# Altium schematic sheet Sensor.SchDoc
size A4; SheetNumber: 7; SheetTotal: 12
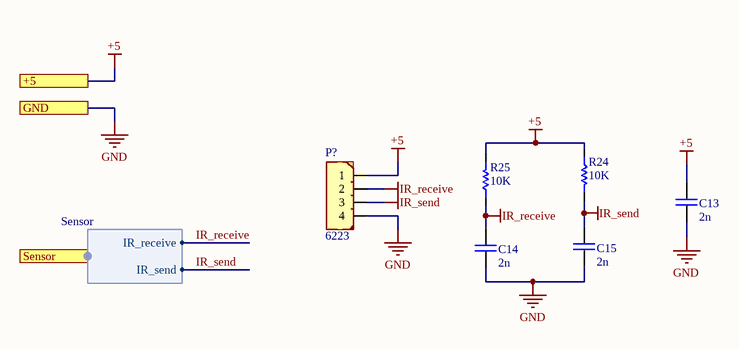
[diagram p0: Sensor.SchDoc]

## Parts
C13  2n  [CAP 1206/3216]
C14  2n  [CAP 1206/3216]
C15  2n  [CAP 1206/3216]
P?  Inflow: 6223  [645004114822]  (hidden comment: 4'Pin)
R24  10K  [RES 1206 (3216X08L)]
R25  10K  [RES 1206 (3216X08L)]

## Ports
+5, GND, Sensor (harness Sensor)

## Harnesses
Sensor: IR_receive, IR_send

## Nets
+5: C13.1 P?.1 R24.1 R25.2 ; port +5
GND: C13.2 C14.2 C15.2 P?.4 ; port GND
IR_receive: C14.1 P?.2 R25.1 ; port Sensor.IR_receive
IR_send: C15.1 P?.3 R24.2 ; port Sensor.IR_send

## Library data of the parts
C13-C15 = Cap_Multi_SMD_100nF_1206: Bipolar ceramic capacitor SMD; Type: MultiLayer; Inflow: inflow?; Rating: 50V; Validation: Valid; Package: 1206; Value: 2n
P? = Con_Power_4_PC_V: 4'Pin Power Connector; Rating: Rating?; Validation: Valid; Value: 4'Pin; Package: Package?; Type: Type?
R24 R25 = Res_SMD_1206: Resistor; Inflow: inflow?; Rating: 0.25W; Validation: Valid; Package: 1206; Type: 10%; Value: 10K